# EasyEDA schematic SCH_flightcomputer-comminication_2025-01-19.json
TITLE: Sheet_1; REV: 1.0; Date: 2024-10-03; Sheet: 1/1; Drawn By: ruihan.zhao13147-bihz; Company: Your Company
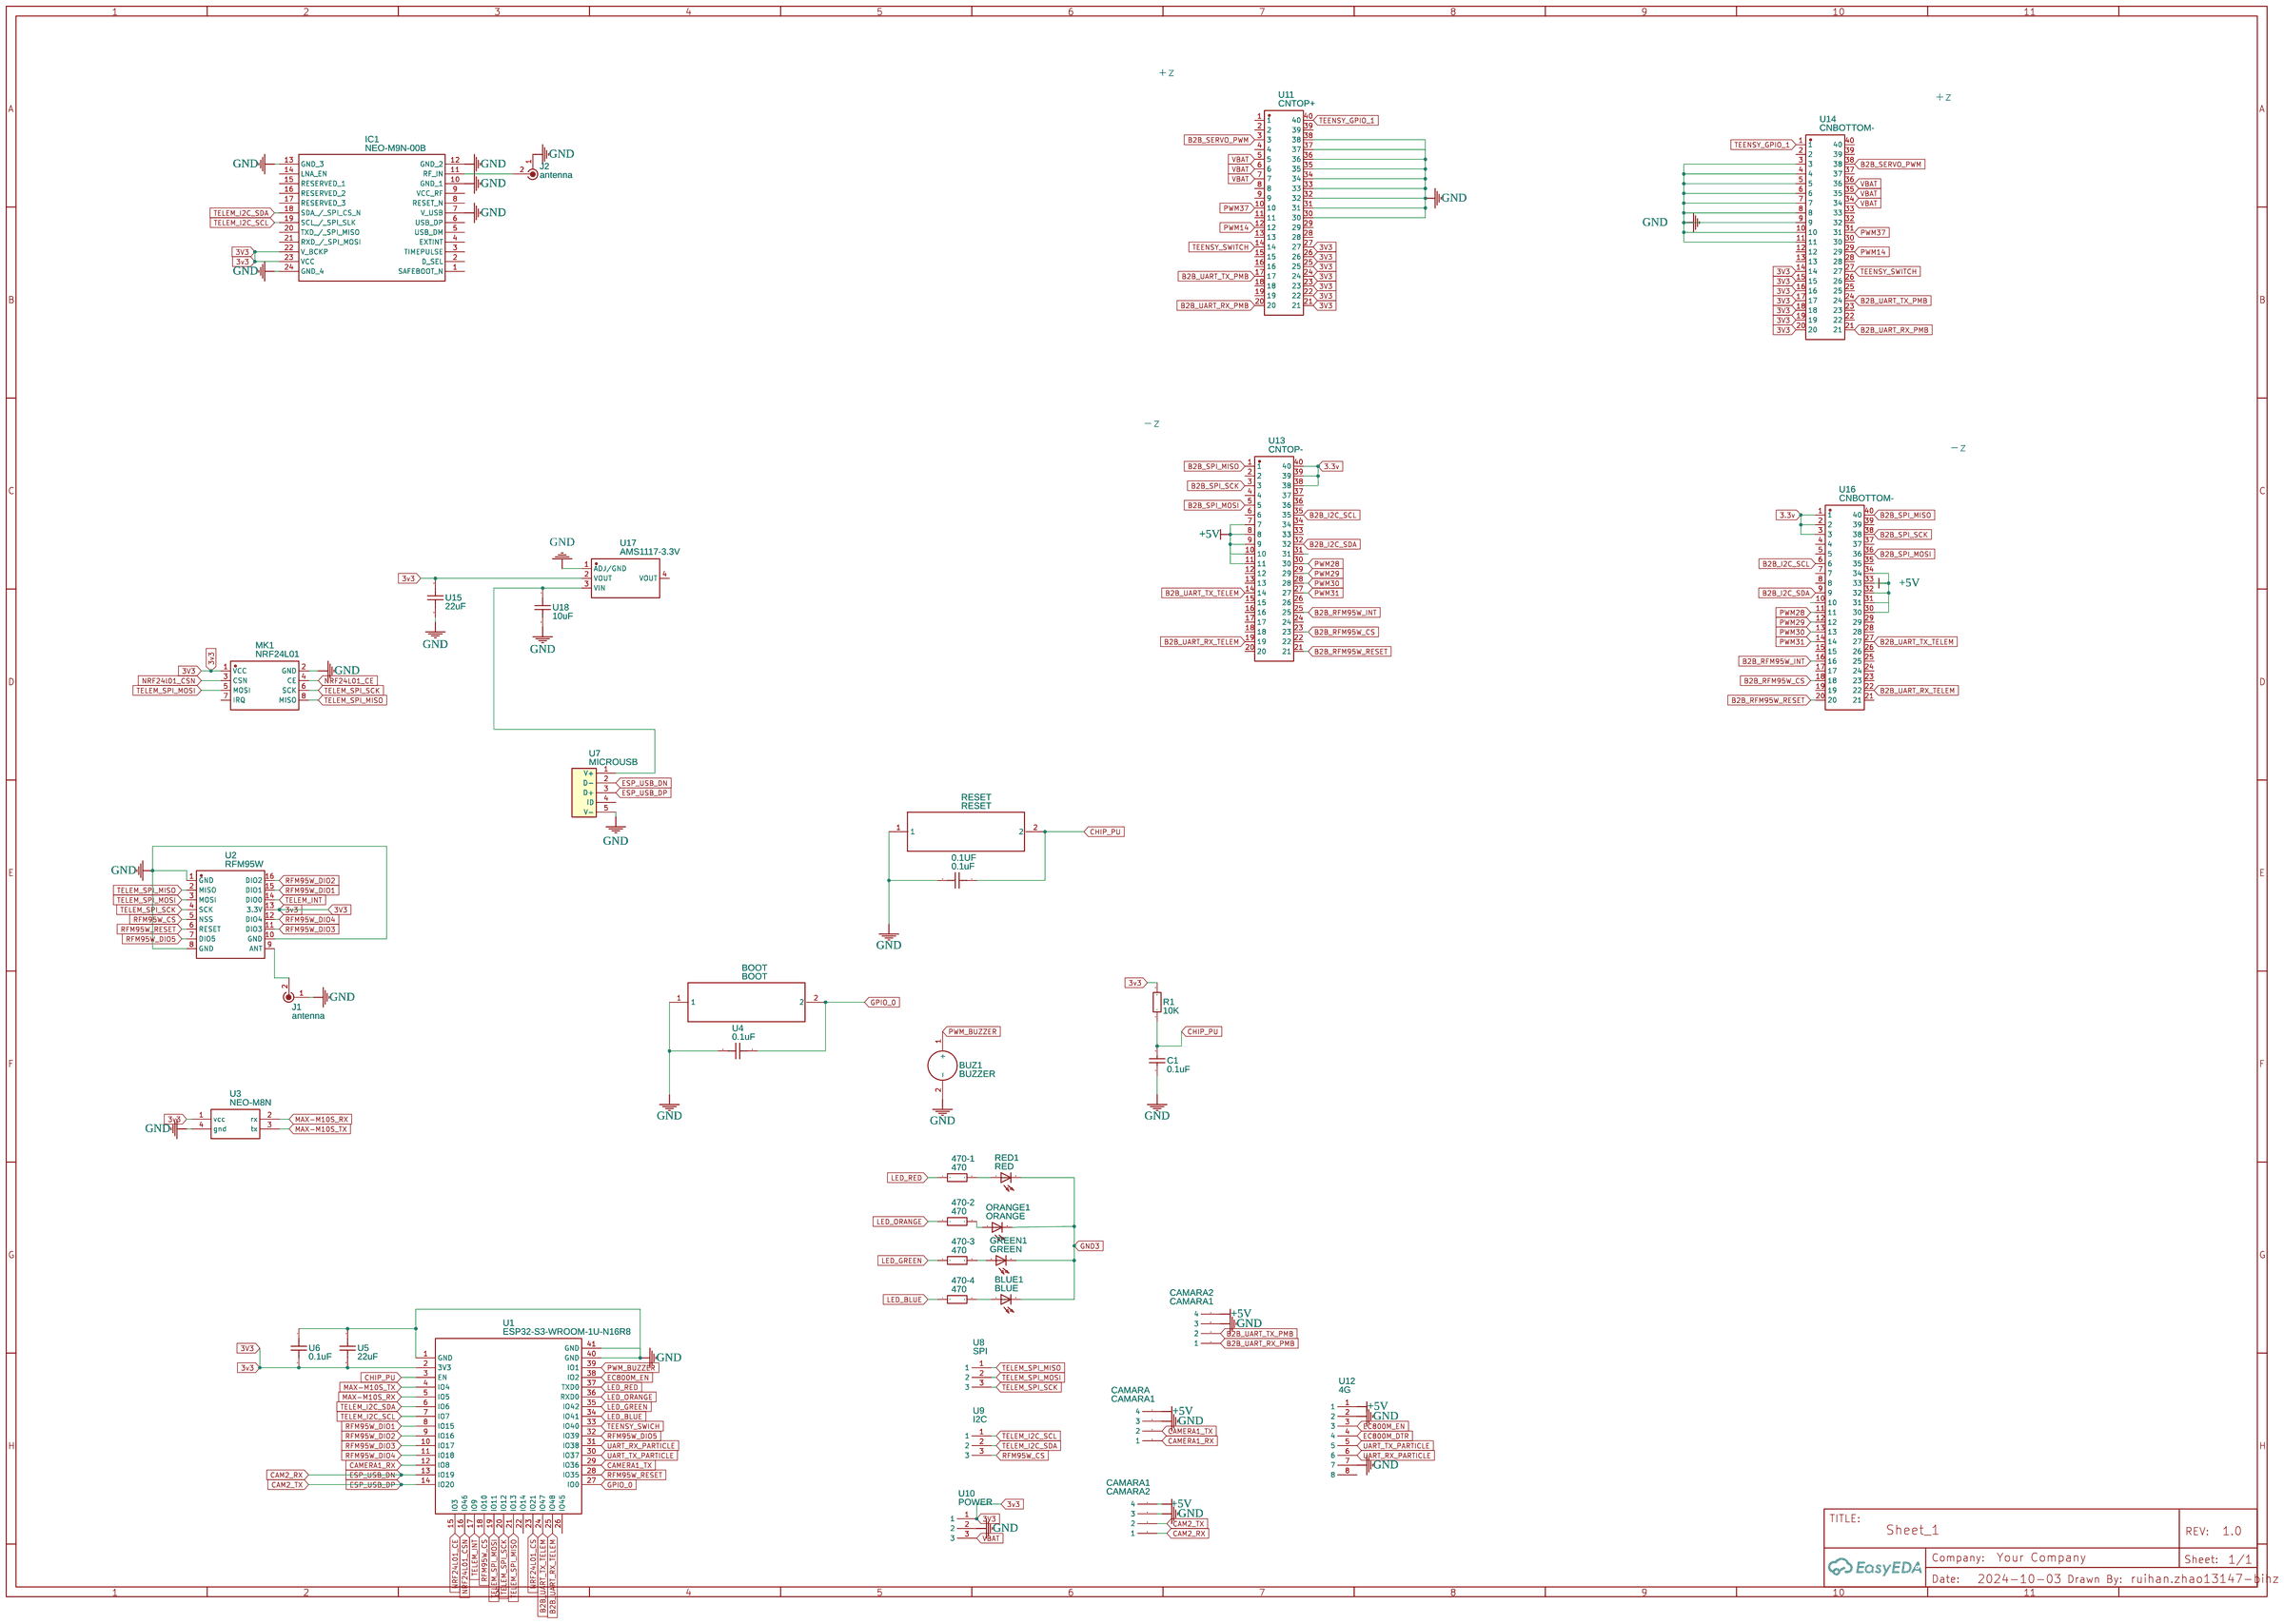
[diagram p0: schematic sheet]

## Parts
0.1UF  0.1uF  [C0805]
470-1  470  [0805 RESISTOR FP]
470-2  470  [0805 RESISTOR FP]
470-3  470  [0805 RESISTOR FP]
470-4  470  [0805 RESISTOR FP]
BLUE1  BLUE  [CHIP-LED0805]
BOOT  BOOT  [SWITCH_FSMSM]
BUZ1  BUZZER  [BUZZER_0905]
C1  0.1uF  [0805]
CAMARA  CAMARA1  [4PINHEADER]
CAMARA1  CAMARA2  [4PINHEADER]
CAMARA2  CAMARA1  [4PINHEADER]
GREEN1  GREEN  [CHIP-LED0805]
IC1  NEO-M9N-00B  [NEOM9N00B]
J1  antenna  [MOLEX_734120114_UMC_RF_CONN_VERTICAL]
J2  antenna  [MOLEX_734120114_UMC_RF_CONN_VERTICAL]
MK1  NRF24L01  [WIRELM-SMD_NRF24L01]
ORANGE1  ORANGE  [CHIP-LED0805]
R1  10K  [R0805]
RED1  RED  [CHIP-LED0805]
RESET  RESET  [SWITCH_FSMSM]
U1  ESP32-S3-WROOM-1U-N16R8  [WIRELM-SMD_ESP32-S3-WROOM-1U]
U2  RFM95W  [COMM-SMD_RFM95W]
U3  NEO-M8N  [GY-GPS6MV2]
U4  0.1uF  [C0805]
U5  22uF  [C0805]
U6  0.1uF  [C0805]
U7  MICROUSB  [MICROUSB-FEMALE]
U8  SPI  [CONNECTOR_PINHEADER_2.54MM:PINHEADER_1X3]
U9  I2C  [CONNECTOR_PINHEADER_2.54MM:PINHEADER_1X3]
U10  POWER  [CONNECTOR_PINHEADER_2.54MM:PINHEADER_1X3]
U11  CNTOP+  [CONN-SMD_40P-P0.80_SGD-JST-BM-08-2X20P-H18-GB0R02]
U12  4G  [8-PIN-CONNECTOR-HEADER]
U13  CNTOP-  [CONN-SMD_40P-P0.80_SGD-JST-BM-08-2X20P-H18-GB0R02]
U14  CNBOTTOM-  [CONN-SMD_40P-P0.80_SGD-JST-BM-08-2X20P-H18-GB0R02]
U15  22uF  [C0805]
U16  CNBOTTOM-  [CONN-SMD_40P-P0.80_SGD-JST-BM-08-2X20P-H18-GB0R02]
U17  AMS1117-3.3V  [SOT-223-4_L6.5-W3.5-P2.30-LS7.0-BR]
U18  10uF  [C0805]

## Library data of the parts
0.1UF U4-U6 U15 U18 = CAP-C0805: Contributor: LCSC; Supplier: LCSC; Supplier Part: C9900009346; Manufacturer: null; JLCPCB Part Class: Extended Part
470-1-470-4 = 0805 Resistor: Contributor: Zephyr Computer Systems
BLUE1 GREEN1 ORANGE1 RED1 = LEDCHIP-LED0805: Contributor: Axelpwm
BOOT RESET = FSMSM: Contributor: marty62
BUZ1 = Buzzer_0905: Contributor: mmaygli
C1 = 0805Cap: Manufacturer: SAMSUNG; LCSC Assembly: Yes; Contributor: Max Koopmanschap
CAMARA CAMARA1 CAMARA2 = 4 Pin Header: Contributor: i3dbee
IC1 = NEO-M9N-00B: Contributor: Ayman Ahmad
J1 J2 = 0734120114: Manufacturer: Molex; Contributor: Michael DiTomo
MK1 = NRF24L01: Supplier: LCSC; Manufacturer: Ai-Thinker(安信可); Manufacturer Part: NF-04; Supplier Part: C90751; JLCPCB Part Class: Extended Part
R1 = 0805: Contributor: LCSC; Supplier: LCSC; Supplier Part: C9900012715; Manufacturer: null; JLCPCB Part Class: Extended Part
U1 = ESP32-S3-WROOM-1U-N16R8: Contributor: lcsc; Supplier: LCSC; Supplier Part: C3013946; Manufacturer: ESPRESSIF(乐鑫); JLCPCB Part Class: Extended Part
U2 = RFM95W: Contributor: LCSC; Supplier: LCSC; Supplier Part: C9900000484; JLCPCB Part Class: Extended Part; Manufacturer: null
U3 = GY-GPS6MV2: Contributor: bapemg
U7 = MICROUSB-FEMALE: Contributor: trieu.ssqa
U8-U10 = 3 pinheader: Contributor: ruihan.zhao13147-bihz
U11 U13 U14 U16 = SGDBM-08-40P: Contributor: LCSC; Supplier: LCSC; Supplier Part: C9900010918; Manufacturer: null; JLCPCB Part Class: Extended Part
U12 = 8pin header: Contributor: ruihan.zhao13147-bihz
U17 = AMS1117-3.3V: Contributor: LCSC; Supplier: LCSC; Supplier Part: C2688239; Manufacturer: WPMtek(维攀); JLCPCB Part Class: Extended Part

## Nets
3.3v: U13.38 U13.39 U13.40 U16.1 U16.2 U16.3
3V3: IC1.22(V_BCKP) IC1.23(VCC) MK1.1(VCC) R1.2 U1.2(3V3) U2.13(3.3V) U3.1(vcc) U5.2 U6.2 U10.1 U11.21 U11.22 U11.23 U11.24 U11.25 U11.26 U11.27 U14.14 U14.15 U14.16 U14.17 U14.18 U14.19 U14.20 U15.1 U17.2(VOUT)
+5V: CAMARA.4 CAMARA1.4 CAMARA2.4 U12.1 U13.7 U13.8 U13.9 U13.10 U13.11 U16.30 U16.31 U16.32 U16.33 U16.34
GND: 0.1UF.2 BOOT.1 BUZ1.2(-) C1.1 CAMARA.3 CAMARA1.3 CAMARA2.3 IC1.7(V_USB) IC1.10(GND_1) IC1.12(GND_2) IC1.13(GND_3) IC1.24(GND_4) J1.1 J2.1 MK1.2(GND) RESET.1 U1.1(GND) U1.40(GND) U1.41(GND) U2.1(GND) U2.8(GND) U2.10(GND) U3.4(gnd) U4.2 U5.1 U6.1 U7.5(V-) U10.2 U11.30 U11.31 U11.32 U11.33 U11.34 U11.35 U11.36 U11.37 U11.38 U12.2 U12.7 U14.3 U14.4 U14.5 U14.6 U14.7 U14.8 U14.9 U14.10 U14.11 U15.2 U17.1(ADJ/GND) U18.2
GND3: BLUE1.C GREEN1.C ORANGE1.C RED1.C
VBAT: U10.3 U11.5 U11.6 U11.7 U14.34 U14.35 U14.36
B2B_I2C_SCL: U13.35 U16.6
B2B_I2C_SDA: U13.32 U16.9
B2B_RFM95W_CS: U13.23 U16.18
B2B_RFM95W_INT: U13.25 U16.16
B2B_RFM95W_RESET: U13.21 U16.20
B2B_SERVO_PWM: U11.3 U14.38
B2B_SPI_MISO: U13.1 U16.40
B2B_SPI_MOSI: U13.5 U16.36
B2B_SPI_SCK: U13.3 U16.38
B2B_UART_RX_PMB: CAMARA2.1 U11.20 U14.21
B2B_UART_RX_TELEM: U1.25(IO48) U13.19 U16.22
B2B_UART_TX_PMB: CAMARA2.2 U11.17 U14.24
B2B_UART_TX_TELEM: U1.24(IO47) U13.14 U16.27
CAM2_RX: CAMARA1.1 U1.13(IO19) U7.2(D-)
CAM2_TX: CAMARA1.2 U1.14(IO20) U7.3(D+)
CAMERA1_RX: CAMARA.1 U1.12(IO8)
CAMERA1_TX: CAMARA.2 U1.29(IO36)
CHIP_PU: 0.1UF.1 C1.2 R1.1 RESET.2 U1.3(EN)
EC800M_DTR: U12.4
EC800M_EN: U1.38(IO2) U12.3
GPIO_0: BOOT.2 U1.27(IO0) U4.1
LED_BLUE: 470-4.1 U1.34(IO41)
LED_GREEN: 470-3.1 U1.35(IO42)
LED_ORANGE: 470-2.1 U1.36(RXD0)
LED_RED: 470-1.1 U1.37(TXD0)
MAX-M10S_RX: U1.5(IO5) U3.2(rx)
MAX-M10S_TX: U1.4(IO4) U3.3(tx)
NRF24L01_CE: MK1.4(CE) U1.15(IO3)
NRF24L01_CS: U1.23(IO21)
NRF24L01_CSN: U1.16(IO46)
NRF24l01_CSN: MK1.3(CSN)
PWM14: U11.12 U14.29
PWM28: U13.30 U16.11
PWM29: U13.29 U16.12
PWM30: U13.28 U16.13
PWM31: U13.27 U16.14
PWM37: U11.10 U14.31
PWM_BUZZER: BUZ1.1(+) U1.39(IO1)
RFM95W_CS: U1.18(IO10) U2.5(NSS) U9.3
RFM95W_DIO1: U1.8(IO15) U2.15(DIO1)
RFM95W_DIO2: U1.9(IO16) U2.16(DIO2)
RFM95W_DIO3: U1.10(IO17) U2.11(DIO3)
RFM95W_DIO4: U1.11(IO18) U2.12(DIO4)
RFM95W_DIO5: U1.32(IO39) U2.7(DIO5)
RFM95W_RESET: U1.28(IO35) U2.6(RESET)
TEENSY_GPIO_1: U11.40 U14.1
TEENSY_SWICH: U1.33(IO40)
TEENSY_SWITCH: U11.14 U14.27
TELEM_I2C_SCL: IC1.19(SCL_/_SPI_SLK) U1.7(IO7) U9.1
TELEM_I2C_SDA: IC1.18(SDA_/_SPI_CS_N) U1.6(IO6) U9.2
TELEM_INT: U1.17(IO9) U2.14(DIO0)
TELEM_SPI_MISO: MK1.8(MISO) U1.21(IO13) U2.2(MISO) U8.1
TELEM_SPI_MOSI: MK1.5(MOSI) U1.19(IO11) U2.3(MOSI) U8.2
TELEM_SPI_SCK: MK1.6(SCK) U1.20(IO12) U2.4(SCK) U8.3
UART_RX_PARTICLE: U1.31(IO38) U12.6
UART_TX_PARTICLE: U1.30(IO37) U12.5
Net-(470-1-2): 470-1.2 RED1.A
Net-(470-2-2): 470-2.2 ORANGE1.A
Net-(470-3-2): 470-3.2 GREEN1.A
Net-(470-4-2): 470-4.2 BLUE1.A
Net-(IC1-11): IC1.11(RF_IN) J2.2
Net-(J1-2): J1.2 U2.9(ANT)
Net-(U7-1): U7.1(V+) U17.3(VIN) U18.1

Not connected (* = marked no-connect by the designer): IC1 1(SAFEBOOT_N) 2(D_SEL) 3(TIMEPULSE) 4(EXTINT) 5(USB_DM) 6(USB_DP) 8(RESET_N) 9(VCC_RF) 14(LNA_EN) 15(RESERVED_1) 16(RESERVED_2) 17(RESERVED_3) 20(TXD_/_SPI_MISO) 21(RXD_/_SPI_MOSI); MK1 7(IRQ); U1 22(IO14) 26(IO45); U7 4(ID); U11 1 2 4 8 9 11 13 15 16 18 19 28 29 39; U12 8; U13 2 4 6 12 13 15 16 17 18 20 22 24 26 31 33 34 36 37; U14 2 12 13 22 23 25 26 28 30 32 33 37 39 40; U16 4 5 7 8 10 15 17 19 21 23 24 25 26 28 29 35 37 39; U17 4(VOUT)

## Notes on the sheet
- +z
- +z
- -z
- -z
